# EAGLE design PT100 Module (EAGLE 9.6.2)
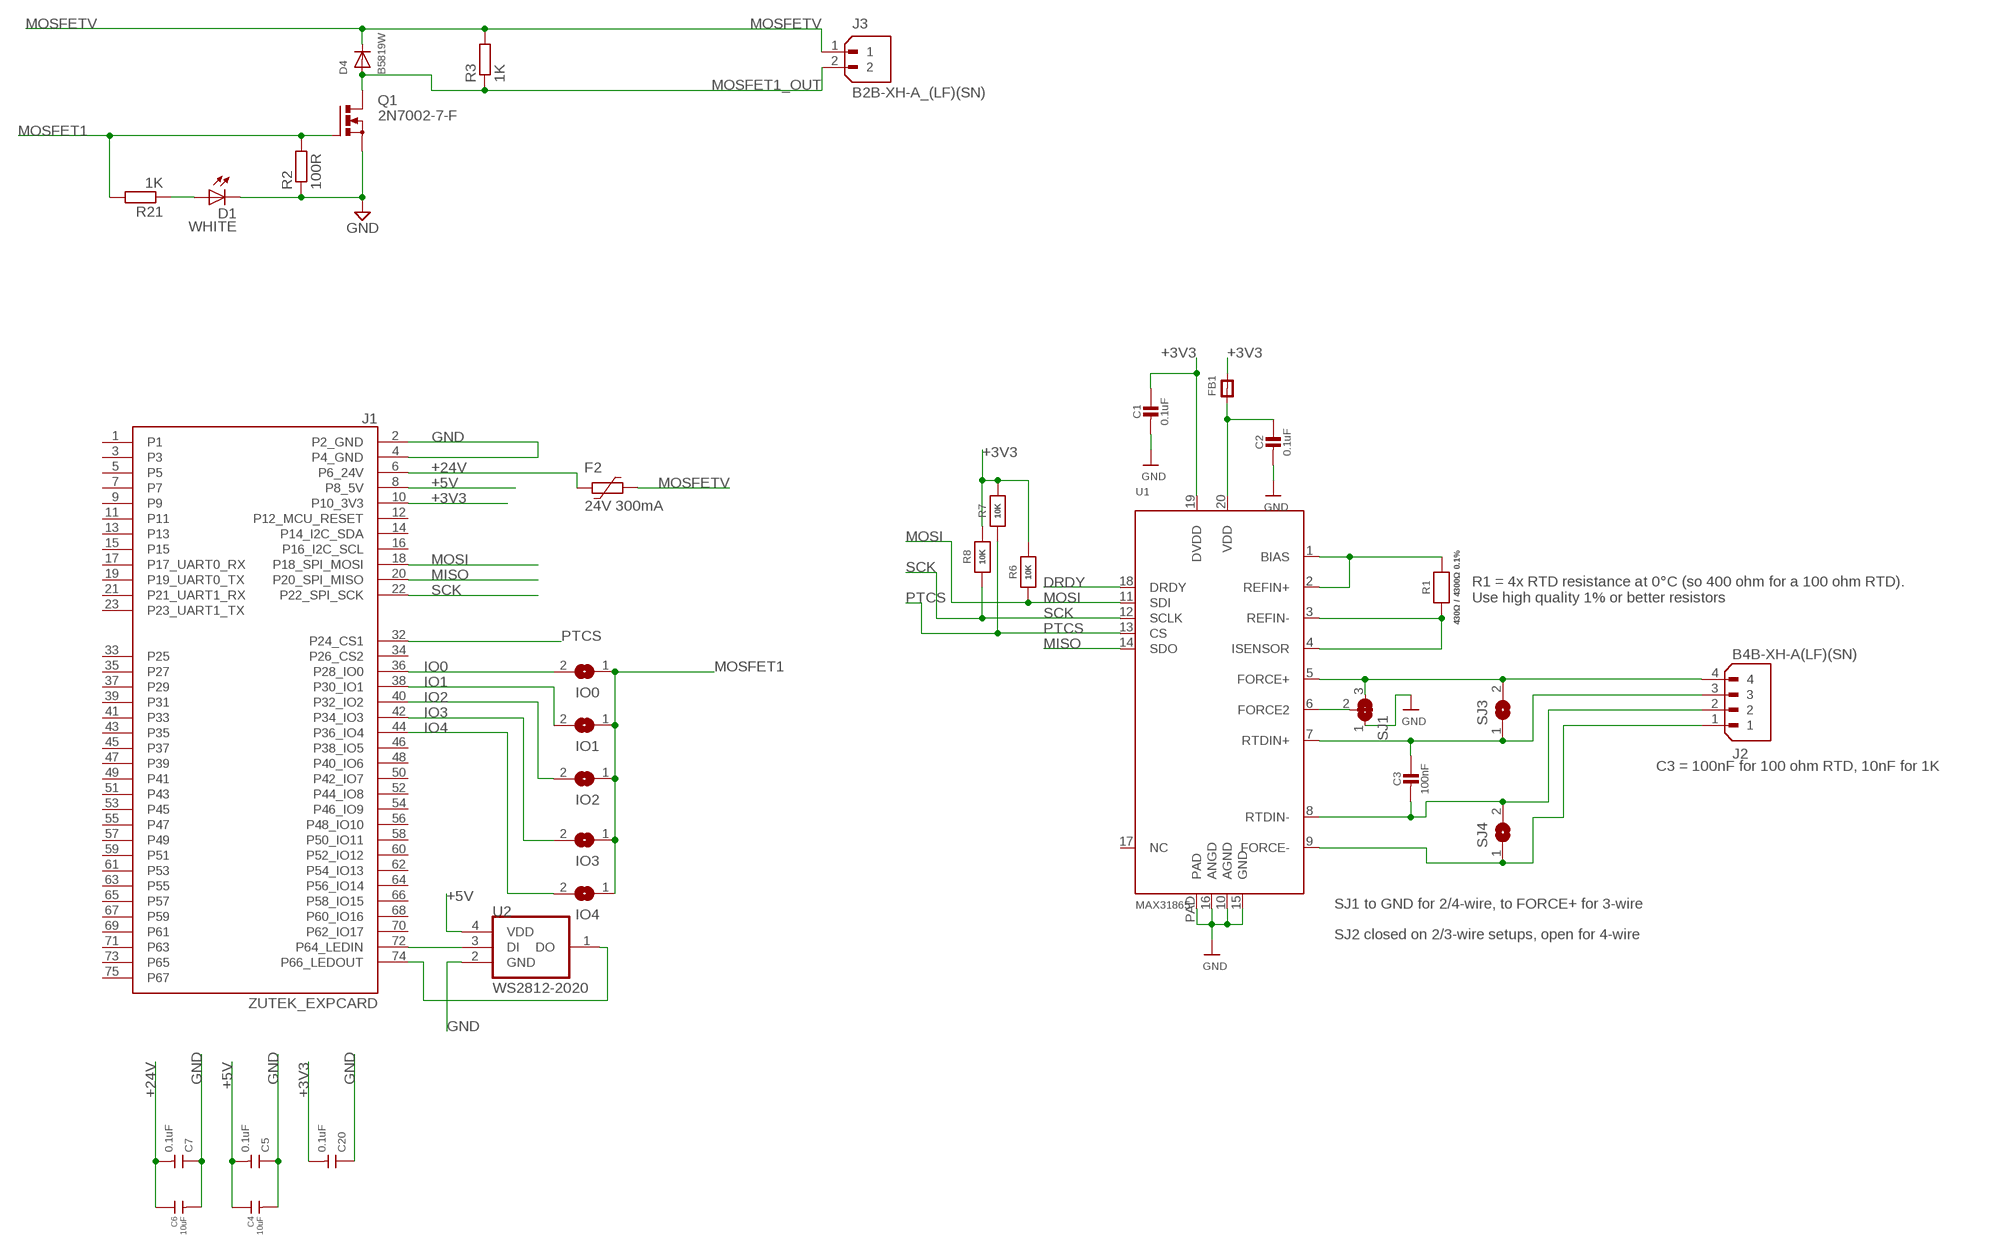
[diagram p0: schematic, sheet 1]

## Parts
C1  0.1uF  CAP_CERAMIC0805-NOOUTLINE  [0805-NO]
C2  0.1uF  CAP_CERAMIC0805-NOOUTLINE  [0805-NO]
C3  100nF  CAP_CERAMIC0805-NOOUTLINE  [0805-NO]
C4  10uF  C-1206  [C1206]
C5  0.1uF  DISCRETE_C-0603  [DISCRETE_C0603]
C6  10uF  C-1206  [C1206]
C7  0.1uF  DISCRETE_C-0603  [DISCRETE_C0603]
C20  0.1uF  DISCRETE_C-0603  [DISCRETE_C0603]
D1  WHITE  LEDCHIP-LED0603  [CHIP-LED0603]
D4  B5819W  [SOD123FL]
F2  24V 300mA  1206L050  [1206L]
FB1  FERRITE-0805NO  [0805-NO]
IO0  SOLDERJUMPERCLOSED  [SOLDERJUMPER_CLOSEDWIRE]
IO1  SOLDERJUMPER  [SOLDERJUMPER_ARROW_NOPASTE]
IO2  SOLDERJUMPER  [SOLDERJUMPER_ARROW_NOPASTE]
IO3  SOLDERJUMPER  [SOLDERJUMPER_ARROW_NOPASTE]
IO4  SOLDERJUMPER  [SOLDERJUMPER_ARROW_NOPASTE]
J1  ZUTEK_EXPCARD  [M.2-CARD-E-22-ZUTEK]
J2  B4B-XH-A(LF)(SN)  [JST_B4B-XH-A(LF)(SN)]
J3  B2B-XH-A_(LF)(SN)  [JST_B2B-XH-A_(LF)(SN)]
Q1  2N7002-7-F  [SOT-23]
R1  430Ω / 4300Ω 0.1%  RESISTOR0805_NOOUTLINE  [0805-NO]
R2  100R  R-EU_R0402  [R0402]
R3  1K  R-EU_R0402  [R0402]
R6  10K  RESISTOR_0402  [_0402]
R7  10K  RESISTOR_0402  [_0402]
R8  10K  RESISTOR_0402  [_0402]
R21  1K  R-EU_R0402  [R0402]
SJ1  SOLDERJUMPER_2WAY  [SOLDERJUMPER_2WAY_OPEN_NOPASTE]
SJ3  SOLDERJUMPER  [SOLDERJUMPER_ARROW_NOPASTE]
SJ4  SOLDERJUMPER  [SOLDERJUMPER_ARROW_NOPASTE]
U1  MAX31865  TEMP_MAX31865  [QFN20_4MM_0.65MM]
U2  WS2812-2020  [LED_WS2812-2020]

## Nets
+3V3: C1.1 C20.2 FB1.2 J1.10(P10_3V3) R6.2 R7.2 R8.2 U1.19(DVDD)
+5V: C4.1 C5.2 J1.8(P8_5V) U2.4(VDD)
+24V: C6.1 C7.2 F2.2 J1.6(P6_24V)
DRDY: U1.18(DRDY)
FORCE+: J2.4 SJ1.3 SJ3.2 U1.5(FORCE+)
FORCE-: J2.1 SJ4.1 U1.9(FORCE-)
GND: C1.2 C2.2 C4.2 C5.1 C6.2 C7.1 C20.1 D1.C J1.2(P2_GND) J1.4(P4_GND) Q1.P2(S) R2.1 SJ1.1 U1.10(AGND) U1.15(GND) U1.16(ANGD) U1.PAD U2.2(GND)
IO0: IO0.2 J1.36(P28_IO0)
IO1: IO1.2 J1.38(P30_IO1)
IO2: IO2.2 J1.40(P32_IO2)
IO3: IO3.2 J1.42(P34_IO3)
IO4: IO4.2 J1.44(P36_IO4)
MISO: J1.20(P20_SPI_MISO) U1.14(SDO)
MOSFET1: IO0.1 IO1.1 IO2.1 IO3.1 IO4.1 Q1.P1(G) R2.2 R21.2
MOSFET1_OUT: D4.A J3.2 Q1.P3(D) R3.1
MOSFETV: D4.C F2.1 J3.1 R3.2
MOSI: J1.18(P18_SPI_MOSI) R6.1 U1.11(SDI)
N$1: R1.1 U1.3(REFIN-) U1.4(ISENSOR)
N$2: R1.2 U1.1(BIAS) U1.2(REFIN+)
N$4: C2.1 FB1.1 U1.20(VDD)
N$7: D1.A R21.1
N$10: J1.72(P64_LEDIN) U2.3(DI)
N$11: SJ1.2 U1.6(FORCE2)
N$14: J1.74(P66_LEDOUT) U2.1(DO)
PTCS: J1.32(P24_CS1) R7.1 U1.13(CS)
RTDIN+: C3.1 J2.3 SJ3.1 U1.7(RTDIN+)
RTDIN-: C3.2 J2.2 SJ4.2 U1.8(RTDIN-)
SCK: J1.22(P22_SPI_SCK) R8.1 U1.12(SCLK)
Unconnected: J1.1 J1.3 J1.5 J1.7 J1.9 J1.11 J1.12(P12_MCU_RESET) J1.13 J1.14(P14_I2C_SDA) J1.15 J1.16(P16_I2C_SCL) J1.17(P17_UART0_RX) J1.19(P19_UART0_TX) J1.21(P21_UART1_RX) J1.23(P23_UART1_TX) J1.33(P25) J1.34(P26_CS2) J1.35(P27) J1.37(P29) J1.39(P31) J1.41(P33) J1.43(P35) J1.45(P37) J1.46(P38_IO5) J1.47(P39) J1.48(P40_IO6) J1.49(P41) J1.50(P42_IO7) J1.51(P43) J1.52(P44_IO8) J1.53(P45) J1.54(P46_IO9) J1.55(P47) J1.56(P48_IO10) J1.57(P49) J1.58(P50_IO11) J1.59(P51) J1.60(P52_IO12) J1.61(P53) J1.62(P54_IO13) J1.63(P55) J1.64(P56_IO14) J1.65(P57) J1.66(P58_IO15) J1.67(P59) J1.68(P60_IO16) J1.69(P61) J1.70(P62_IO17) J1.71(P63) J1.73(P65) J1.75(P67) U1.17(NC)

## Notes on the sheet
- R1 = 4x RTD resistance at 0°C (so 400 ohm for a 100 ohm RTD).
  Use high quality 1% or better resistors
- C3 = 100nF for 100 ohm RTD, 10nF for 1K
- SJ1 to GND for 2/4-wire, to FORCE+ for 3-wire
- SJ2 closed on 2/3-wire setups, open for 4-wire

## Library data of the parts
C1-C3 = microbuilder:CAP_CERAMIC: Ceramic Capacitors For new designs, use the packages preceded by an '_' character since they are more reliable: The following footprints should be used on most boards: _0402 - Standard footprint for regular board layouts _0603 - Standard footprint for regular board layouts _0805 - Standard footprint for regular board layouts _1206 - Standard footprint for regular board layouts For extremely tight-pitch boards where space is at a premium, the following 'micro-pitch' footprints can be used (smaller pads, no silkscreen outline, etc.): _0402MP - Micro-pitch footprint for very dense/compact boards _0603MP - Micro-pitch footprint for very dense/compact boards _0805MP - Micro-pitch footprint for very dense/compact boards _1206MP - Micro-pitch footprint for very dense/compact boards
C4 C6 = discrete:C*: Ceramic Capacitors
C5 C7 C20 = A9G:DISCRETE_C*: Ceramic Capacitors
D1 = adafruit:LED: LED OSRAM: - CHIPLED LG R971, LG N971, LY N971, LG Q971, LY Q971, LO R971, LY R971 LH N974, LH R974 LS Q976, LO Q976, LY Q976 LO Q996 - Hyper CHIPLED LW Q18S LB Q993, LB Q99A, LB R99A - SideLED LS A670, LO A670, LY A670, LG A670, LP A670 LB A673, LV A673, LT A673, LW A673 LH A674 LY A675 LS A676, LA A676, LO A676, LY A676, LW A676 LS A679, LY A679, LG A679 - Hyper Micro SIDELED® LS Y876, LA Y876, LO Y876, LY Y876 LT Y87S - SmartLED LW L88C, LW L88S LB L89C, LB L89S, LG L890 LS L89K, LO L89K, LY L89K LS L896, LA L896, LO L896, LY L896 - TOPLED LS T670, LO T670, LY T670, LG T670, LP T670 LSG T670, LSP T670, LSY T670, LOP T670, LYG T670 LG T671, LOG T671, LSG T671 LB T673, LV T673, LT T673, LW T673 LH T674 LS T676, LA T676, LO T676, LY T676, LB T676, LH T676, LSB T676, LW T676 LB T67C, LV T67C, LT T67C, LS T67K, LO T67K, LY T67K, LW E67C LS E67B, LA E67B, LO E67B, LY E67B, LB E67C, LV E67C, LT E67C LW T67C LS T679, LY T679, LG T679 LS T770, LO T770, LY T770, LG T770, LP T770 LB T773, LV T773, LT T773, LW T773 LH T774 LS E675, LA E675, LY E675, LS T675 LS T776, LA T776, LO T776, LY T776, LB T776 LHGB T686 LT T68C, LB T68C - Hyper Mini TOPLED® LB M676 - Mini TOPLED Santana® LG M470 LS M47K, LO M47K, LY M47K Source: http://www.osram.convergy.de/
D4 = B5819W:B5819W: Check availability <https://pricing.snapeda.com/parts/B5819W/Microdiode%20Electronics/view-part?ref=eda>; AVAILABILITY: In Stock; CHECK_PRICES: https://www.snapeda.com/parts/B5819W/Applied+Avionics/view-part/?ref=eda; DESCRIPTION: Rectifier Diode Schottky 40V 1A 2-Pin SOD-123; MF: Microdiode Electronics; MP: B5819W; PACKAGE: None; PRICE: None; SNAPEDA_LINK: https://www.snapeda.com/parts/B5819W/Applied+Avionics/view-part/?ref=snap
F2 = polyfuse-smd_10:?: Polyfuse Resettable PTC Source: http://www.littelfuse.com/products/resettable-ptcs.aspx; MF: Littelfuse; MPN: 1206L050; OC_FARNELL: 1596993; OC_NEWARK: 53M6118
FB1 = microbuilder:FERRITE: Ferrite Bead 0603 MMZ1608B121C - 120 Ohm @ 100MHz, 600mA, 0.15 Ohm DC Resistance - Digikey: 445-2164-1-ND BK1608HW121-T - 120 Ohm, 600mA Ferrite Chip - Digikey: 587-1876-2-ND 0805 HZ0805B272R-10 - 2.7K Ohm @ 100MHz, 200mA, 0.8 Ohm DC Resistance - Digikey: 240-2504-1-ND (see also Murata BLM21BD272SN1L) MMZ2012Y152B - 1.5K Ohm @ 100MHz, 500mA, 0.4 Ohm DC Resistance - Digikey: 445-1560-1-ND - Mainly for high frequency (80-400MHz) MMZ2012R102A - 1K Ohm @ 100MHz, 500mA, 0.3 Ohm DC Resistance - Digikey: 445-1555-2-ND - More general purpose (10-200MHz)
IO0 = microbuilder:SOLDERJUMPER: SMD Solder JUMPER Solder the two pads together to create a connection, or remove the solder to break it. REFLOW - Use this footprint for solder paste and reflow ovens. WAVE - Use this footprint for hand-soldering (larger pads). CLOSED - Has a trace between the two pads to ensure it is closed by default. The trace needs to be cut to disable the jumper, and can be closed again by creating a solder bridge between the two pads.
IO1-IO4 SJ3 SJ4 = microbuilder:SOLDERJUMPER: SMD Solder JUMPER Solder the two pads together to create a connection, or remove the solder to break it. REFLOW - Use this footprint for solder paste and reflow ovens. WAVE - Use this footprint for hand-soldering (larger pads). CLOSED - Has a trace between the two pads to ensure it is closed by default. The trace needs to be cut to disable the jumper, and can be closed again by creating a solder bridge between the two pads.; BOM: EXCLUDE
J1 = zutek_m.2:ZUTEK_EXP: MicroMod Connector Description: A card edge connector and mating PCB connector to allow various MicroMod Processor Boards to be coupled with various carrier boards of different capabilities. Based on the M.2 standard.
J2 = B4B-XH-A_LF__SN_:B4B-XH-A(LF)(SN): Check availability <https://pricing.snapeda.com/parts/B4B-XH-A%20%28LF%29%28SN%29/JST%20Sales/view-part?ref=eda>; AVAILABILITY: In Stock; CHECK_PRICES: https://www.snapeda.com/parts/B4B-XH-A%20(LF)(SN)/JST/view-part/?ref=eda; DESCRIPTION: Connector Header Through Hole 4 position 0.098 (2.50mm); MF: JST Sales; MP: B4B-XH-A (LF)(SN); PACKAGE: None; PRICE: None; SNAPEDA_LINK: https://www.snapeda.com/parts/B4B-XH-A%20(LF)(SN)/JST/view-part/?ref=snap
J3 = B2B-XH-A__LF__SN_:B2B-XH-A_(LF)(SN): Check availability <https://pricing.snapeda.com/parts/B2B-XH-A%20%28LF%29%28SN%29/JST%20Sales/view-part?ref=eda>; AVAILABILITY: In Stock; CHECK_PRICES: https://www.snapeda.com/parts/B2B-XH-A%20(LF)(SN)/JST/view-part/?ref=eda; DESCRIPTION: Connector Header Through Hole 2 position 0.098 (2.50mm); MF: JST Sales; MP: B2B-XH-A (LF)(SN); PACKAGE: None; PRICE: None; SNAPEDA_LINK: https://www.snapeda.com/parts/B2B-XH-A%20(LF)(SN)/JST/view-part/?ref=snap
Q1 = mosfet:2N7002-7-F: Nch MOSFET IRLML6344 30V 5A http://akizukidenshi.com/catalog/g/gI-06049/ I-06049
R1 R6-R8 = microbuilder:RESISTOR: Resistors For new designs, use the packages preceded by an '_' character since they are more reliable: The following footprints should be used on most boards: _0402 - Standard footprint for regular board layouts _0603 - Standard footprint for regular board layouts _0805 - Standard footprint for regular board layouts _1206 - Standard footprint for regular board layouts For extremely tight-pitch boards where space is at a premium, the following 'micro-pitch' footprints can be used (smaller pads, no silkscreen outline, etc.): _0402MP - Micro-pitch footprint for very dense/compact boards _0603MP - Micro-pitch footprint for very dense/compact boards _0805MP - Micro-pitch footprint for very dense/compact boards _1206MP - Micro-pitch footprint for very dense/compact boards
R2 R21 = rcl:R-EU_: RESISTOR, European symbol; SPICEPREFIX: R
R3 = rcl:R-EU_: RESISTOR, European symbol; LCSC_PART: C11702; SPICEPREFIX: R
SJ1 = microbuilder:SOLDERJUMPER_2WAY: 2-Way Solder Jumper
U1 = microbuilder:TEMP_MAX31865: MAX31865 - Resistance to Digital Convertor for Platinum Resistance Temperature Detectors (RTDs) Handles 100 ohm - 1K ohm (at 0°C) platinum RTDs. 15-bit ADC resolution (nominally 0.03125°C), 0.5°C accuracy.
U2 = WS2812-2020:WS2812-2020: Check availability <https://pricing.snapeda.com/parts/WS2812-2020/Worldsemi/view-part?ref=eda>; AVAILABILITY: Not in stock; CHECK_PRICES: https://www.snapeda.com/parts/WS2812-2020/Worldsemi/view-part/?ref=eda; DESCRIPTION: Intelligent control LED light source, SMD-4; MF: Worldsemi; MP: WS2812-2020; PACKAGE: Package; PRICE: None; SNAPEDA_LINK: https://www.snapeda.com/parts/WS2812-2020/Worldsemi/view-part/?ref=snap

## Net classes
0 default: width 0.178 mm, drill 0.305 mm

## Board
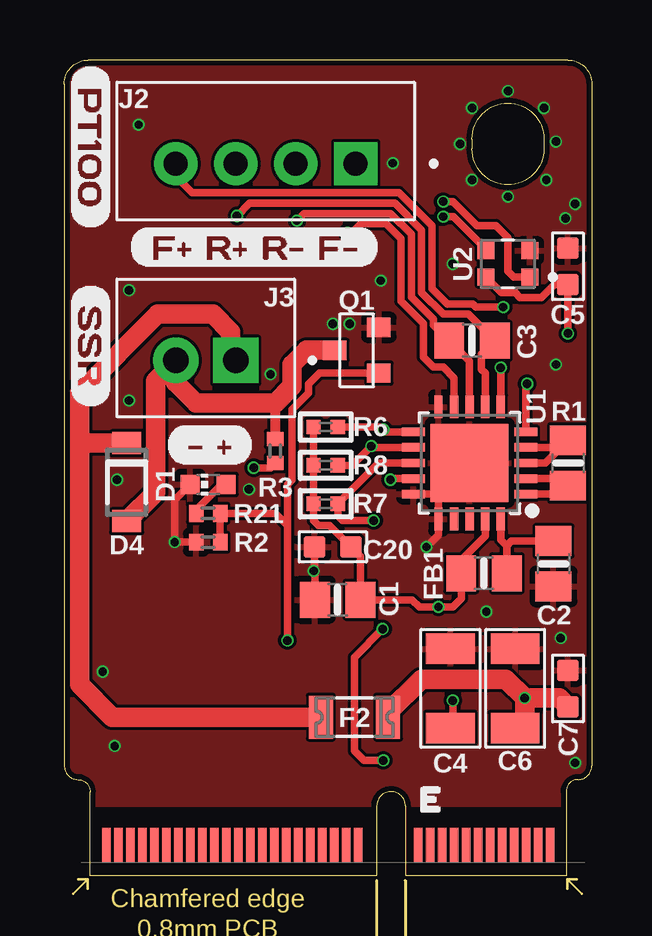
[diagram p1: board, top side]
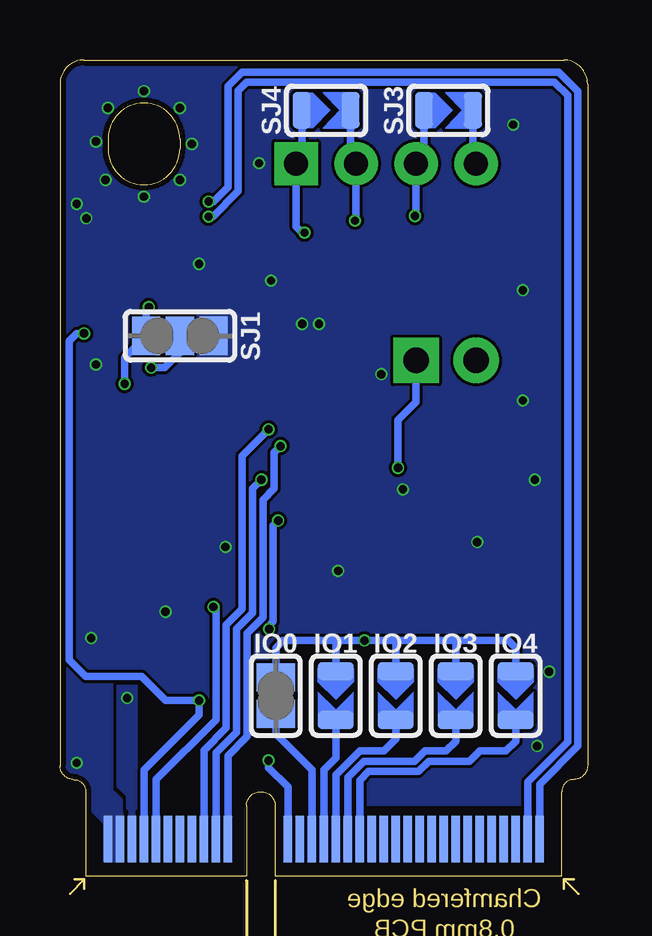
[diagram p2: board, bottom side, seen from below]

Size 22 x 34 mm. Coordinates in mm from the lower left corner, seen from the top.
Outline: 20.93,0 14.22,0 14.22,2.9 arc180 13.03,2.9 13.03,0 1.07,0 1.07,3.5 arc90 0.57,4 arc-90 0,4.58 0,33 arc-90 1,34 21,34 arc-90 22,33 22,4.58 arc-90 21.43,4 arc90 20.93,3.5 20.93,0
Outline: 17,30.7 arc-180 20,30.7 20,30.3 arc-180 17,30.3 17,30.7
Copper layers (1*16): Top 0.035mm / dielectric 1.6mm / Bottom 0.035mm
Design rules "jlcpcb-2layers *": minimum track width 5mil, minimum drill 0.3mm, track to track 5mil, track to pad 5mil, pad to pad 5mil, via to via 5mil, smd to smd 5mil, copper to edge 0.2mm, drill to drill 6mil, minimum pad ring 10mil, minimum via ring 3mil, stop-mask expansion 4mil, vias tented up to drill 40mil, thermal gap 10mil

### Footprints (pad centres in the part's own frame; a part is rotated, then mirrored left to right if it is on the bottom)
0805-NO = smd 1.24 x 1.5: 1 -0.95,0; 2 0.95,0
C1206 = smd 1.27 x 2.032: 1 -1.651,0; 2 1.651,0
DISCRETE_C0603 = smd 0.889 x 0.889: 1 -0.762,0; 2 0.762,0
CHIP-LED0603 = smd 0.8 x 0.8: A 0,-0.75; C 0,0.75
SOD123FL = smd 0.91 x 1.22: A 1.625,0; C -1.625,0
1206L = smd 1 x 1.8: 1 -1.4,0; 2 1.4,0
SOLDERJUMPER_CLOSEDWIRE = smd 1.168 x 1.6: 1 -0.762,0; 2 0.762,0 | smd 0.635 x 0.203: WIRE 0,0
SOLDERJUMPER_ARROW_NOPASTE = smd 0.762 x 1.524: 1 -1.016,0; 2 1.016,0
M.2-CARD-E-22-ZUTEK = smd 0.35 x 1.45: 1 9.25,1.275; 3 8.75,1.275; 5 8.25,1.275; 7 7.75,1.275; 9 7.25,1.275; 11 6.75,1.275; 13 6.25,1.275; 15 5.75,1.275; 17 5.25,1.275; 19 4.75,1.275; 21 4.25,1.275; 23 3.75,1.275; 33 1.25,1.275; 35 0.75,1.275; 37 0.25,1.275; 39 -0.25,1.275; 41 -0.75,1.275; 43 -1.25,1.275; 45 -1.75,1.275; 47 -2.25,1.275; 49 -2.75,1.275; 51 -3.25,1.275; 53 -3.75,1.275; 55 -4.25,1.275; 57 -4.75,1.275; 59 -5.25,1.275; 61 -5.75,1.275; 63 -6.25,1.275; 65 -6.75,1.275; 67 -7.25,1.275; 69 -7.75,1.275; 71 -8.25,1.275; 73 -8.75,1.275; 75 -9.25,1.275 | smd 0.35 x 1.95 bottom: 2 9,1.525; 4 8.5,1.525; 6 8,1.525; 8 7.5,1.525; 10 7,1.525; 12 6.5,1.525; 14 6,1.525; 16 5.5,1.525; 18 5,1.525; 20 4.5,1.525; 22 4,1.525; 32 1.5,1.525; 34 1,1.525; 36 0.5,1.525; 38 0,1.525; 40 -0.5,1.525; 42 -1,1.525; 44 -1.5,1.525; 46 -2,1.525; 48 -2.5,1.525; 50 -3,1.525; 52 -3.5,1.525; 54 -4,1.525; 56 -4.5,1.525; 58 -5,1.525; 60 -5.5,1.525; 62 -6,1.525; 64 -6.5,1.525; 66 -7,1.525; 68 -7.5,1.525; 70 -8,1.525; 72 -8.5,1.525; 74 -9,1.525
JST_B4B-XH-A(LF)(SN) = drill 1 square: 1 3.75,-0.525 | drill 1: 2 1.25,-0.525; 3 -1.25,-0.525; 4 -3.75,-0.525
JST_B2B-XH-A_(LF)(SN) = drill 1.05 square: 1 1.25,-0.525 | drill 1.05: 2 -1.25,-0.525
SOT-23 = smd 0.802 x 0.972: P1 -0.95,-0.917; P2 0.95,-0.917; P3 0,0.917
R0402 = smd 0.6 x 0.7: 1 -0.5,0; 2 0.5,0
_0402 = smd 0.6 x 0.6: 1 -0.508,0; 2 0.508,0
SOLDERJUMPER_2WAY_OPEN_NOPASTE = smd 1.168 x 1.6: 1 -1.397,0; 2 0,0; 3 1.397,0
QFN20_4MM_0.65MM = smd 0.35 x 0.95: 1 -1.3,-2.34; 2 -0.65,-2.34; 3 0,-2.34; 4 0.65,-2.34; 5 1.3,-2.34; 11 1.3,2.34; 12 0.65,2.34; 13 0,2.34; 14 -0.65,2.34; 15 -1.3,2.34 | smd 0.95 x 0.35: 6 2.34,-1.3; 7 2.34,-0.65; 8 2.34,0; 9 2.34,0.65; 10 2.34,1.3; 16 -2.34,1.3; 17 -2.34,0.65; 18 -2.34,0; 19 -2.34,-0.65; 20 -2.34,-1.3 | smd 3.25 x 3.25: PAD 0,0
LED_WS2812-2020 = smd 0.7 x 0.7: 1 0.915,-0.55; 2 0.915,0.55; 3 -0.915,0.55; 4 -0.915,-0.55

### Placement (x,y rotation side)
C1  11.4,11.5 180 top
C2  20.4,13 270 top
C3  17,22.3 180 top
C4  16.1,7.8 90 top
C5  21,25.4 270 top
C6  18.8,7.8 90 top
C7  21,7.8 270 top
C20  11.2,13.7 0 top
D1  6,16.3 90 top
D4  2.6,16.4 270 top
F2  12.1,6.6 0 top
FB1  17.5,12.6 180 top
IO0  13,7.5 270 bottom
IO1  10.5,7.5 270 bottom
IO2  8,7.5 270 bottom
IO3  5.5,7.5 270 bottom
IO4  3,7.5 270 bottom
J1  11,0 0 top
J2  8.4,30.2 0 top
J3  5.9,22 0 top
Q1  12.2,21.9 90 top
R1  21,17.2 270 top
R2  6,13.9 0 top
R3  8.8,17.7 270 top
R6  10.9,18.7 180 top
R7  10.9,15.5 180 top
R8  10.9,17.1 180 top
R21  6,15.1 0 top
SJ1  17,22.5 180 bottom
SJ3  5.8,31.9 0 bottom
SJ4  10.9,31.9 0 bottom
U1  16.9,17.2 90 top
U2  18.5,25.5 0 top
U$4  [PT1000]  1.1,33.8 270 top
U$5  [SSR0]  1.1,24.7 270 top
U$7  [#_#0]  4.25,17.95 0 top
U$8  [F#_R#_R#_F#0]  2.7,26.2 0 top

### Tracks (layer width: path | path; a pad name or v marks a point on that pad's centre or on a via)
+3V3  (via drill 0.35)
  Top 0.305: U1.19 17.55,14.15 16.55,13.15 FB1.2 16.55,11.55 16.2,11.2 v15.6,11.2 14.8,11.2 14.5,11.5 C1.1 12.35,13.31 C20.2 11.06,14.6 10.6,14.6 10.39,14.81 R7.2 R8.2 R6.2
  Bottom 0.305: J1.10 18,4 15.5,6.5 15.5,11.1 v15.6,11.2
+5V  (via drill 0.35)
  Top 0.305: v16.2,7.3 16.2,6.25 C4.1 | U2.4 18.23,24.3 18.8,24.3 19,24.1 19.9,24.1 20.44,24.64 C5.2 v21,22.6
  Bottom 0.305: J1.8 18.5,4.4 16.2,6.7 v16.2,7.3 17.6,7.3 18.6,8.3 20.92,8.3 21.62,9 21.62,22.28 21.3,22.6 v21,22.6
+24V  (via drill 0.35)
  Top 0.813: C6.1 19.2,6.55 v19.2,7.4 | C7.2 20.64,7.4 v19.2,7.4 | v19.2,7.4 18.41,8.19 14.88,8.19 13.5,6.8 F2.2
  pour Bottom (no thermals): 18.9,0.6 18.9,2.7 18.8,2.8 18.8,7.91 19.6,7.91 19.6,3.7 19.2,3.3 19.2,2.8 19.1,2.7 19.1,0.6
FORCE+  (via drill 0.35)
  Top 0.305: U1.5 19.24,20.44 v19.3,20.5 | v18.3,23.7 17.16,23.7 17.03,23.83 15.98,23.83 15.33,24.48 15.33,27.09 13.96,28.46 5.34,28.46 4.65,29.15 J2.4
  Bottom 0.305: v19.3,20.5 19.3,21.6 SJ1.3 18.4,23.6 v18.3,23.7 | SJ3.2 4.78,29.81 J2.4
FORCE-  (via drill 0.35)
  Top 0.305: U1.9 16.25,20.75 15.8,21.2 15.38,21.2 14.97,21.62 14.97,23.01 14.04,23.94 14.04,26.55 13.42,27.17 12.37,27.17 12,26.8 v11.8,26.8
  Bottom 0.305: SJ4.1 11.92,29.91 J2.1 12.15,27.05 11.9,26.8 v11.8,26.8
GND  (via drill 0.35)
  Top 0.305: C20.1 10.44,12.74 | 10.44,12.74 v10.4,12.7 | C1.2 10.45,12.73 10.44,12.74 | v15.1,13.7 15.6,14.2 U1.16 15.6,15.9 | 15.6,15.9 U1.PAD | U1.15 15.6,15.9 | D1.C 4.6,15.65 v4.6,13.9 R2.1
  other vias: 21.3,28 20.9,27.4 18.5,28.3 20.5,30.6 16.5,30.5 18.5,32.7 17,32 20,32 20.1,29 17,29 21.3,4.7 20.7,9.9 17.6,11 2.1,5.4 1.6,8.5 2.2,16.5 2.7,19.8 2.7,24.4 13.2,24.8 11.9,23 11.2,23 16.2,25.5 13.7,29.7 3.1,31.3 20.5,21.3 7.7,16.1 8.6,20.9
  pour Bottom (rank 6, no thermals): 19.4,0.65 19.4,3.2 19.8,3.6 19.8,8.05 19.7,8.15 18.7,8.15 18.6,8.05 18.6,3 18.55,2.95 0.85,2.95 0,3.8 0,33.55 0.5,34.05 21.5,34.05 22.1,33.45 22.1,4.4 20.95,3.25 20.95,2.95 20.15,2.15 20.15,0.6 19.45,0.6
  pour Top (isolate 0.1): 0,3 22,3 22,34 0,34
IO0
  Bottom 0.305: J1.36 11.5,4.4 13,5.9 IO0.2
IO1
  Bottom 0.305: J1.38 11,4.4 10.5,4.9 IO1.2
IO2
  Bottom 0.305: J1.40 10.5,4.2 9.5,5.2 8.5,5.2 8,5.7 IO2.2
IO3
  Bottom 0.305: J1.42 10,4.09 9.32,4.77 7.22,4.77 6.79,5.2 5.9,5.2 5.5,5.6 IO3.2
IO4
  Bottom 0.305: J1.44 9.5,3.98 9.14,4.34 7.04,4.34 6.61,4.77 4.92,4.77 4.49,5.2 3.4,5.2 3,5.6 IO4.2
MISO  (via drill 0.35)
  Top 0.305: v13.6,16.5 13.65,16.55 U1.14
  Bottom 0.305: J1.20 15.5,5.11 14.63,5.98 14.63,10.28 13.97,10.94 13.97,16.13 v13.6,16.5
MOSFET1  (via drill 0.35)
  Top 0.305: Q1.P1 10.65,20.95 10.19,20.49 10.19,20.12 9.5,19.43 9.5,16.5 9.3,16.3 9.3,14.6 | 9.3,14.6 v9.3,9.8 | 9.3,14.6 8.8,15.1 R21.2 R2.2
  Bottom 0.305: 10.5,9.8 v9.3,9.8 8,9.8 | 10.5,9.8 12.7,9.8 13,9.5 IO0.1 | IO1.1 10.5,9.8 | IO4.1 3,9.5 3.3,9.8 5.4,9.8 | 5.4,9.8 8,9.8 | IO2.1 8,9.8 | IO3.1 5.5,9.7 5.4,9.8
MOSFET1_OUT
  Top 0.406: R3.1 8.8,19.7
  Top 0.813: D4.A 3.8,15.97 3.8,20.62 J3.2 4.65,20.55 5.5,19.7 8.8,19.7 9.5,20.4 9.5,21.3 10.1,21.9 Q1.P3
MOSFETV  (via drill 0.35)
  Top 0.305: R3.2 8.6,17 v7.9,17
  Top 0.813: F2.1 2,6.6 0.63,7.97 0.63,17.9 | 0.63,17.9 0.63,20.13 3.9,23.4 6.2,23.4 6.93,22.66 6.93,21.81 7.15,21.6 J3.1 | D4.C 0.76,18.02 0.63,17.9
  Bottom 0.305: v7.9,17 7.9,19 7.15,19.75 J3.1
MOSI  (via drill 0.35)
  Top 0.305: U1.11 13.4,18.5 v13.3,18.6 13.2,18.7 R6.1
  Bottom 0.305: J1.18 16,5.22 15.06,6.16 15.06,10.46 14.4,11.12 14.4,17.5 v13.3,18.6
N$1
  Top 0.305: U1.4 20.7,17.85 | 20.7,17.85 R1.1 | U1.3 20.05,17.2 20.7,17.85
N$2
  Top 0.305: U1.2 20.7,16.55 R1.2 20.65,15.9 U1.1
N$4
  Top 0.305: FB1.1 18.45,13.75 | U1.20 18.2,14 18.45,13.75 | C2.1 18.65,13.95 18.45,13.75
N$7
  Top 0.305: R21.1 5.5,15.25 6.55,16.3 D1.A
N$10  (via drill 0.35)
  Top 0.305: U2.3 17.59,26.1 16.22,27.47 v15.8,27.47
  Bottom 0.305: J1.72 2.5,3.91 0.83,5.58 0.83,32.52 1.38,33.07 14.22,33.07 14.57,32.72 14.57,28.52 15.62,27.47 v15.8,27.47
N$11  (via drill 0.35)
  Top 0.305: U1.6 v18.2,21.17
  Bottom 0.305: v18.2,21.17 17.63,21.17 17,21.8 SJ1.2
N$14  (via drill 0.35)
  Top 0.305: U2.1 18.75,24.95 18.5,25.2 18.5,26.6 18,27.1 17.2,27.1 16.2,28.1 v15.8,28.1
  Bottom 0.305: J1.74 2,3.8 0.4,5.4 0.4,32.7 1.2,33.5 14.4,33.5 15,32.9 15,28.7 15.6,28.1 v15.8,28.1
PTCS  (via drill 0.35)
  Top 0.305: U1.13 13.1,17.2 R7.1 11.41,14.99 11.6,14.8 v12.9,14.8 | v13.3,4.8 12.5,4.8 12.1,5.2 12.1,9.1 v13.28,10.28
  Bottom 0.305: J1.32 12.5,3.7 13.3,4.5 v13.3,4.8 | v13.28,10.28 13.28,10.41 13.11,10.59 13.11,14.6 v12.9,14.8
RTDIN+  (via drill 0.35)
  Top 0.305: U1.7 17.55,20.95 17.4,21.1 17.4,21.75 C3.1 16.85,23.4 15.8,23.4 14.9,24.3 14.9,26.91 13.78,28.03 7.73,28.03 v7.2,27.5
  Bottom 0.305: v7.2,27.5 7.15,27.55 J2.3 6.82,30.01 SJ3.1
RTDIN-  (via drill 0.35)
  Top 0.305: U1.8 16.9,21.45 C3.2 15.4,22.95 15.4,23.19 14.47,24.12 14.47,26.73 13.6,27.6 10,27.6 v9.7,27.3
  Bottom 0.305: v9.7,27.3 9.65,27.35 J2.2 9.88,29.91 SJ4.2
SCK  (via drill 0.35)
  Top 0.305: R8.1 12,17.1 v12.8,17.9 12.85,17.85 U1.12
  Bottom 0.305: J1.22 15,5 14.2,5.8 14.2,10.1 13.54,10.76 13.54,15.66 13.07,16.13 13.07,17.63 v12.8,17.9